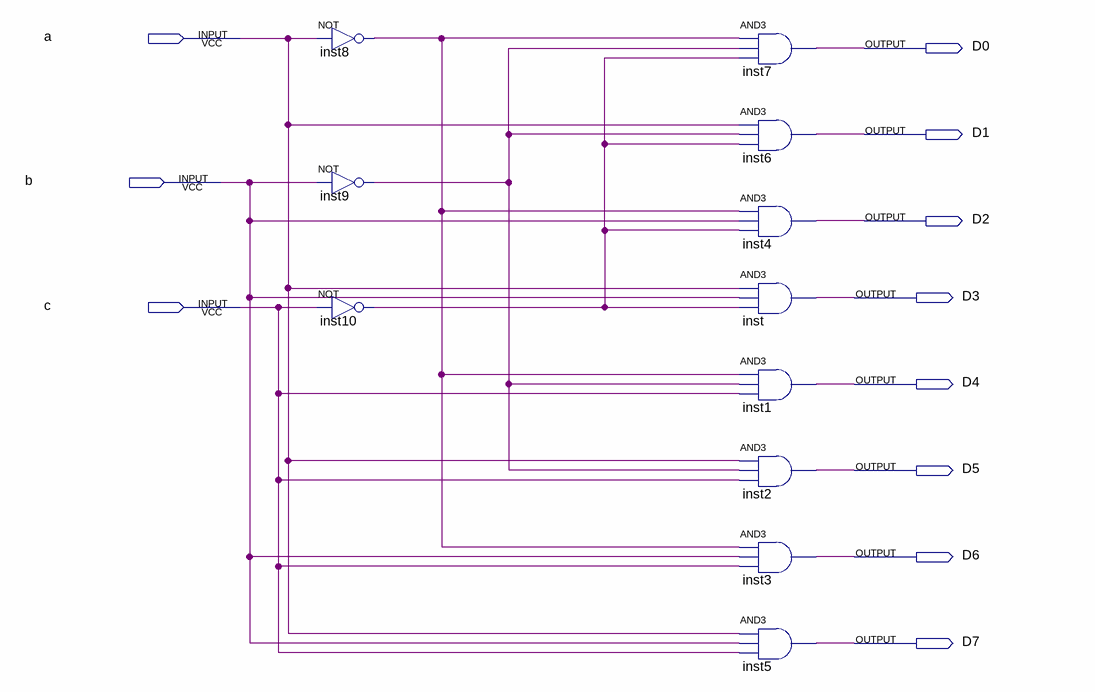
[diagram p0: schematic sheet]
// Quartus schematic Fun3to8.bdf as structural Verilog: 11 symbols, 11 pins
module Fun3to8 (
  input  a,
  input  b,
  input  c,
  output D0,
  output D1,
  output D2,
  output D3,
  output D4,
  output D5,
  output D6,
  output D7
);

  wire inst8_out, inst9_out, inst10_out;

  not inst8 (inst8_out, a);
  not inst9 (inst9_out, b);
  not inst10 (inst10_out, c);
  and inst7 (D0, inst8_out, inst9_out, inst10_out);
  and inst6 (D1, a, inst9_out, inst10_out);
  and inst4 (D2, inst8_out, b, inst10_out);
  and inst (D3, a, b, inst10_out);
  and inst1 (D4, inst8_out, inst9_out, c);
  and inst2 (D5, a, inst9_out, c);
  and inst3 (D6, inst8_out, b, c);
  and inst5 (D7, a, b, c);
endmodule
